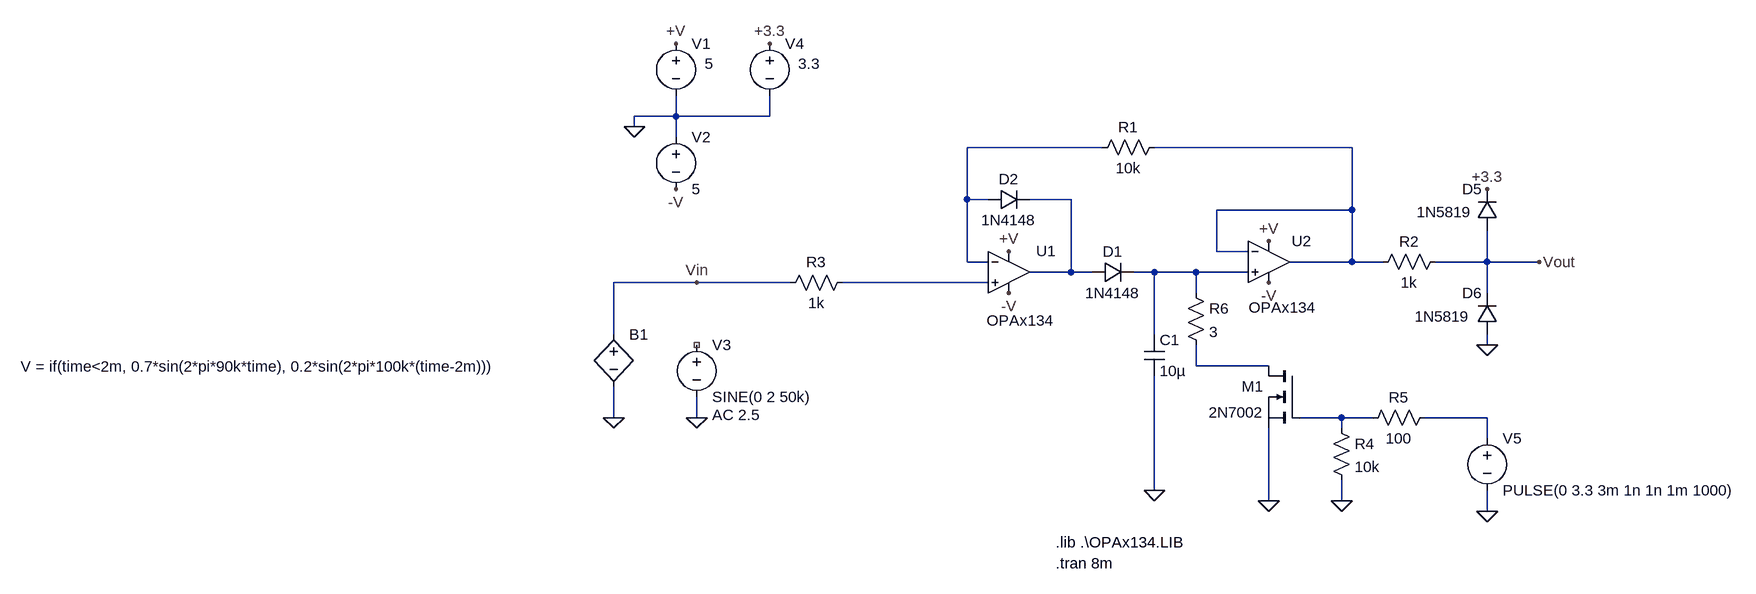
[diagram p0: schematic Detector de pico.asc]
Detector de pico.asc, the LTspice schematic file:
Version 4.1
SHEET 1 1280 680
WIRE -432 -112 -432 -144
WIRE -432 -112 -496 -112
WIRE -288 -112 -288 -144
WIRE -288 -112 -432 -112
WIRE -496 -96 -496 -112
WIRE -432 -80 -432 -112
WIRE 224 -64 16 -64
WIRE 608 -64 304 -64
WIRE 16 16 16 -64
WIRE 48 16 16 16
WIRE 176 16 112 16
WIRE 608 32 608 -64
WIRE 608 32 400 32
WIRE 400 96 400 32
WIRE 448 96 400 96
WIRE 16 112 16 16
WIRE 48 112 16 112
WIRE 608 112 608 32
WIRE 608 112 512 112
WIRE 656 112 608 112
WIRE 816 112 816 64
WIRE 816 112 736 112
WIRE 896 112 816 112
WIRE 176 128 176 16
WIRE 176 128 112 128
WIRE 208 128 176 128
WIRE 304 128 272 128
WIRE 368 128 304 128
WIRE 448 128 368 128
WIRE -400 144 -528 144
WIRE -256 144 -400 144
WIRE 48 144 -176 144
WIRE 368 160 368 128
WIRE 816 160 816 112
WIRE -528 224 -528 144
WIRE 304 224 304 128
WIRE 816 240 816 224
WIRE 368 272 368 240
WIRE 480 272 368 272
WIRE -528 352 -528 304
WIRE -400 352 -400 320
WIRE 592 352 528 352
WIRE 640 352 592 352
WIRE 816 352 720 352
WIRE 592 368 592 352
WIRE 816 384 816 352
WIRE 304 464 304 288
WIRE 480 480 480 368
WIRE 592 480 592 448
WIRE 816 496 816 464
FLAG 304 464 0
FLAG 480 80 +V
FLAG 80 96 +V
FLAG 480 144 -V
FLAG 80 160 -V
FLAG -400 144 Vin
FLAG 896 112 Vout
FLAG -496 -96 0
FLAG -432 -224 +V
FLAG -432 0 -V
FLAG -400 352 0
FLAG -288 -224 +3.3
FLAG 816 0 +3.3
FLAG 816 240 0
FLAG -528 352 0
FLAG 480 480 0
FLAG 592 480 0
FLAG 816 496 0
SYMBOL OpAmps\\opamp2 80 64 R0
WINDOW 0 42 31 Left 2
WINDOW 3 -34 138 Left 2
SYMATTR InstName U1
SYMATTR Value OPAx134
SYMBOL OpAmps\\opamp2 480 48 R0
WINDOW 0 35 32 Left 2
WINDOW 3 -31 134 Left 2
SYMATTR InstName U2
SYMATTR Value OPAx134
SYMBOL diode 208 144 R270
WINDOW 0 32 32 VTop 2
WINDOW 3 0 32 VBottom 2
SYMATTR InstName D1
SYMATTR Value 1N4148
SYMBOL diode 48 32 R270
WINDOW 0 32 32 VTop 2
WINDOW 3 0 32 VBottom 2
SYMATTR InstName D2
SYMATTR Value 1N4148
SYMBOL res 320 -80 R90
WINDOW 0 0 56 VBottom 2
WINDOW 3 32 56 VTop 2
SYMATTR InstName R1
SYMATTR Value 10k
SYMBOL cap 288 224 R0
SYMATTR InstName C1
SYMATTR Value 10µ
SYMATTR SpiceLine V=16 Irms=0 Rser=0 Lser=0
SYMBOL voltage -432 -240 R0
WINDOW 3 44 47 Left 2
WINDOW 123 0 0 Left 0
WINDOW 39 0 0 Left 0
SYMATTR Value 5
SYMATTR InstName V1
SYMBOL voltage -432 -96 R0
WINDOW 123 0 0 Left 0
WINDOW 39 0 0 Left 0
SYMATTR InstName V2
SYMATTR Value 5
SYMBOL voltage -400 224 R0
WINDOW 123 24 124 Left 2
WINDOW 39 0 0 Left 0
SYMATTR Value2 AC 2.5
SYMATTR InstName V3
SYMATTR Value SINE(0 2 50k)
SYMBOL res 752 96 R90
WINDOW 0 0 56 VBottom 2
WINDOW 3 32 56 VTop 2
SYMATTR InstName R2
SYMATTR Value 1k
SYMBOL res -160 128 R90
WINDOW 0 0 56 VBottom 2
WINDOW 3 32 56 VTop 2
SYMATTR InstName R3
SYMATTR Value 1k
SYMBOL diode 832 64 R180
WINDOW 0 24 64 Left 2
WINDOW 3 40 29 Left 2
SYMATTR InstName D5
SYMATTR Value 1N5819
SYMBOL diode 832 224 R180
WINDOW 0 24 64 Left 2
WINDOW 3 43 28 Left 2
SYMATTR InstName D6
SYMATTR Value 1N5819
SYMBOL voltage -288 -240 R0
WINDOW 3 44 47 Left 2
WINDOW 123 0 0 Left 0
WINDOW 39 0 0 Left 0
SYMATTR Value 3.3
SYMATTR InstName V4
SYMBOL bv -528 208 R0
WINDOW 3 -912 65 Left 2
SYMATTR Value V = if(time<2m, 0.7*sin(2*pi*90k*time), 0.2*sin(2*pi*100k*(time-2m)))
SYMATTR InstName B1
SYMBOL nmos 528 272 M0
SYMATTR InstName M1
SYMATTR Value 2N7002
SYMBOL res 576 352 R0
SYMATTR InstName R4
SYMATTR Value 10k
SYMBOL res 736 336 R90
WINDOW 0 0 56 VBottom 2
WINDOW 3 32 56 VTop 2
SYMATTR InstName R5
SYMATTR Value 100
SYMBOL voltage 816 368 R0
WINDOW 123 0 0 Left 0
WINDOW 39 0 0 Left 0
SYMATTR InstName V5
SYMATTR Value PULSE(0 3.3 3m 1n 1n 1m 1000)
SYMBOL res 352 144 R0
SYMATTR InstName R6
SYMATTR Value 3
TEXT 152 544 Left 2 !.lib .\\OPAx134.LIB
TEXT 152 576 Left 2 !.tran 8m

The netlist it stands for:
* Detector de pico.asc
X§U1 N005 N001 +V -V N003 OPAx134  ; pins In+ In- V+ V- OUT
X§U2 N004 N002 +V -V N002 OPAx134  ; pins In+ In- V+ V- OUT
D1 N003 N004 1N4148
D2 N001 N003 1N4148
R1 N002 N001 10k
C1 N004 0 10µ V=16 Irms=0 Rser=0 Lser=0
V1 +V 0 5
V2 0 -V 5
V3 NC_01 0 SINE(0 2 50k) AC 2.5
R2 Vout N002 1k
R3 N005 Vin 1k
D5 Vout +3.3 1N5819
D6 0 Vout 1N5819
V4 +3.3 0 3.3
B1 Vin 0 V = if(time<2m, 0.7*sin(2*pi*90k*time), 0.2*sin(2*pi*100k*(time-2m)))
M1 N006 N007 0 0 2N7002
R4 N007 0 10k
R5 N008 N007 100
V5 N008 0 PULSE(0 3.3 3m 1n 1n 1m 1000)
R6 N004 N006 3
.model D D
.lib standard.dio
.model NMOS NMOS
.model PMOS PMOS
.lib standard.mos
.lib .\OPAx134.LIB
.tran 8m
.backanno
.end